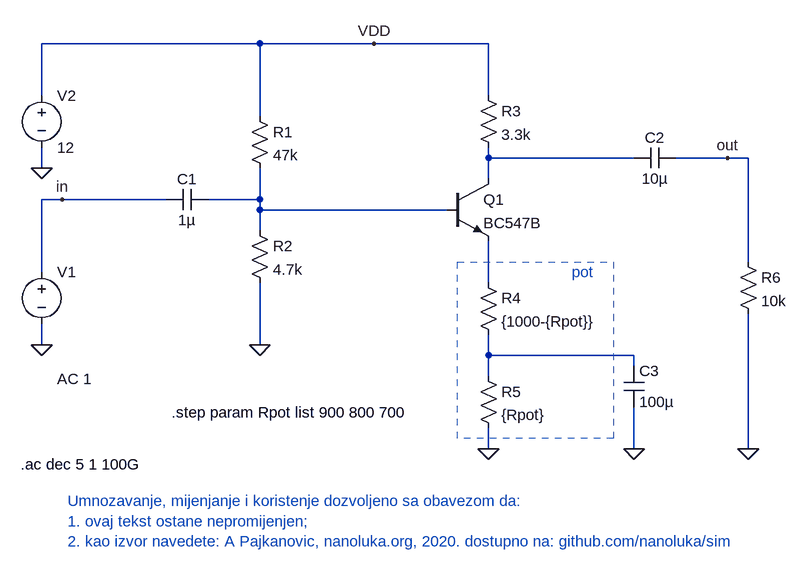
[diagram p0: schematic negativnaPovratnaSprega.asc]
negativnaPovratnaSprega.asc, the LTspice schematic file:
Version 4
SHEET 1 912 744
WIRE 96 -32 -240 -32
WIRE 272 -32 96 -32
WIRE 448 -32 272 -32
WIRE -240 48 -240 -32
WIRE 448 48 448 -32
WIRE 96 80 96 -32
WIRE 448 144 448 128
WIRE 672 144 448 144
WIRE 816 144 736 144
WIRE 848 144 816 144
WIRE -240 160 -240 128
WIRE 448 176 448 144
WIRE -208 208 -240 208
WIRE -48 208 -208 208
WIRE 96 208 96 160
WIRE 96 208 16 208
WIRE 96 224 96 208
WIRE 384 224 96 224
WIRE 96 256 96 224
WIRE 848 304 848 144
WIRE -240 320 -240 208
WIRE 448 336 448 272
WIRE -240 432 -240 400
WIRE 96 432 96 336
WIRE 448 448 448 416
WIRE 672 448 448 448
WIRE 672 464 672 448
WIRE 448 480 448 448
WIRE 448 592 448 560
WIRE 672 592 672 528
WIRE 848 592 848 384
FLAG -240 432 0
FLAG 96 432 0
FLAG 448 592 0
FLAG 848 592 0
FLAG -240 160 0
FLAG 272 -32 VDD
FLAG 672 592 0
FLAG -208 208 in
FLAG 816 144 out
SYMBOL res 80 64 R0
SYMATTR InstName R1
SYMATTR Value 47k
SYMBOL res 80 240 R0
SYMATTR InstName R2
SYMATTR Value 4.7k
SYMBOL res 432 32 R0
SYMATTR InstName R3
SYMATTR Value 3.3k
SYMBOL res 432 320 R0
SYMATTR InstName R4
SYMATTR Value {1000-{Rpot}}
SYMBOL res 432 464 R0
SYMATTR InstName R5
SYMATTR Value {Rpot}
SYMBOL cap 16 192 R90
WINDOW 0 0 32 VBottom 2
WINDOW 3 32 32 VTop 2
SYMATTR InstName C1
SYMATTR Value 1µ
SYMBOL cap 736 128 R90
WINDOW 0 0 32 VBottom 2
WINDOW 3 32 32 VTop 2
SYMATTR InstName C2
SYMATTR Value 10µ
SYMBOL res 832 288 R0
SYMATTR InstName R6
SYMATTR Value 10k
SYMBOL voltage -240 304 R0
WINDOW 3 24 152 Left 2
WINDOW 123 24 180 Left 2
WINDOW 39 0 0 Left 0
SYMATTR Value ""
SYMATTR Value2 AC 1
SYMATTR InstName V1
SYMBOL voltage -240 32 R0
WINDOW 123 0 0 Left 0
WINDOW 39 0 0 Left 0
SYMATTR InstName V2
SYMATTR Value 12
SYMBOL npn 384 176 R0
SYMATTR InstName Q1
SYMATTR Value BC547B
SYMBOL cap 656 464 R0
SYMATTR InstName C3
SYMATTR Value 100µ
TEXT 576 320 Left 2 ;pot
TEXT -272 616 Left 2 !.ac dec 5 1 100G
TEXT -40 536 Left 2 !.step param Rpot list 900 800 700
TEXT -200 672 Left 2 ;Umnozavanje, mijenjanje i koristenje dozvoljeno sa obavezom da:\n1. ovaj tekst ostane nepromijenjen;\n2. kao izvor navedete: A Pajkanovic, nanoluka.org, 2020. dostupno na: github.com/nanoluka/sim
RECTANGLE Normal 640 576 400 304 2

The netlist it stands for:
* negativnaPovratnaSprega.asc
R1 VDD N002 47k
R2 N002 0 4.7k
R3 VDD N001 3.3k
R4 N003 N004 {1000-{Rpot}}
R5 N004 0 {Rpot}
C1 N002 in 1µ
C2 out N001 10µ
R6 out 0 10k
V1 in 0 AC 1
V2 VDD 0 12
Q1 N001 N002 N003 0 BC547B
C3 N004 0 100µ
.model NPN NPN
.model PNP PNP
.lib standard.bjt
* pot
.ac dec 5 1 100G
.step param Rpot list 900 800 700
* Umnozavanje, mijenjanje i koristenje dozvoljeno sa obavezom da:
* 1. ovaj tekst ostane nepromijenjen;
* 2. kao izvor navedete: A Pajkanovic, nanoluka.org, 2020. dostupno na: github.com/nanoluka/sim
.backanno
.end